# EAGLE design W404C (EAGLE 6.6.0)
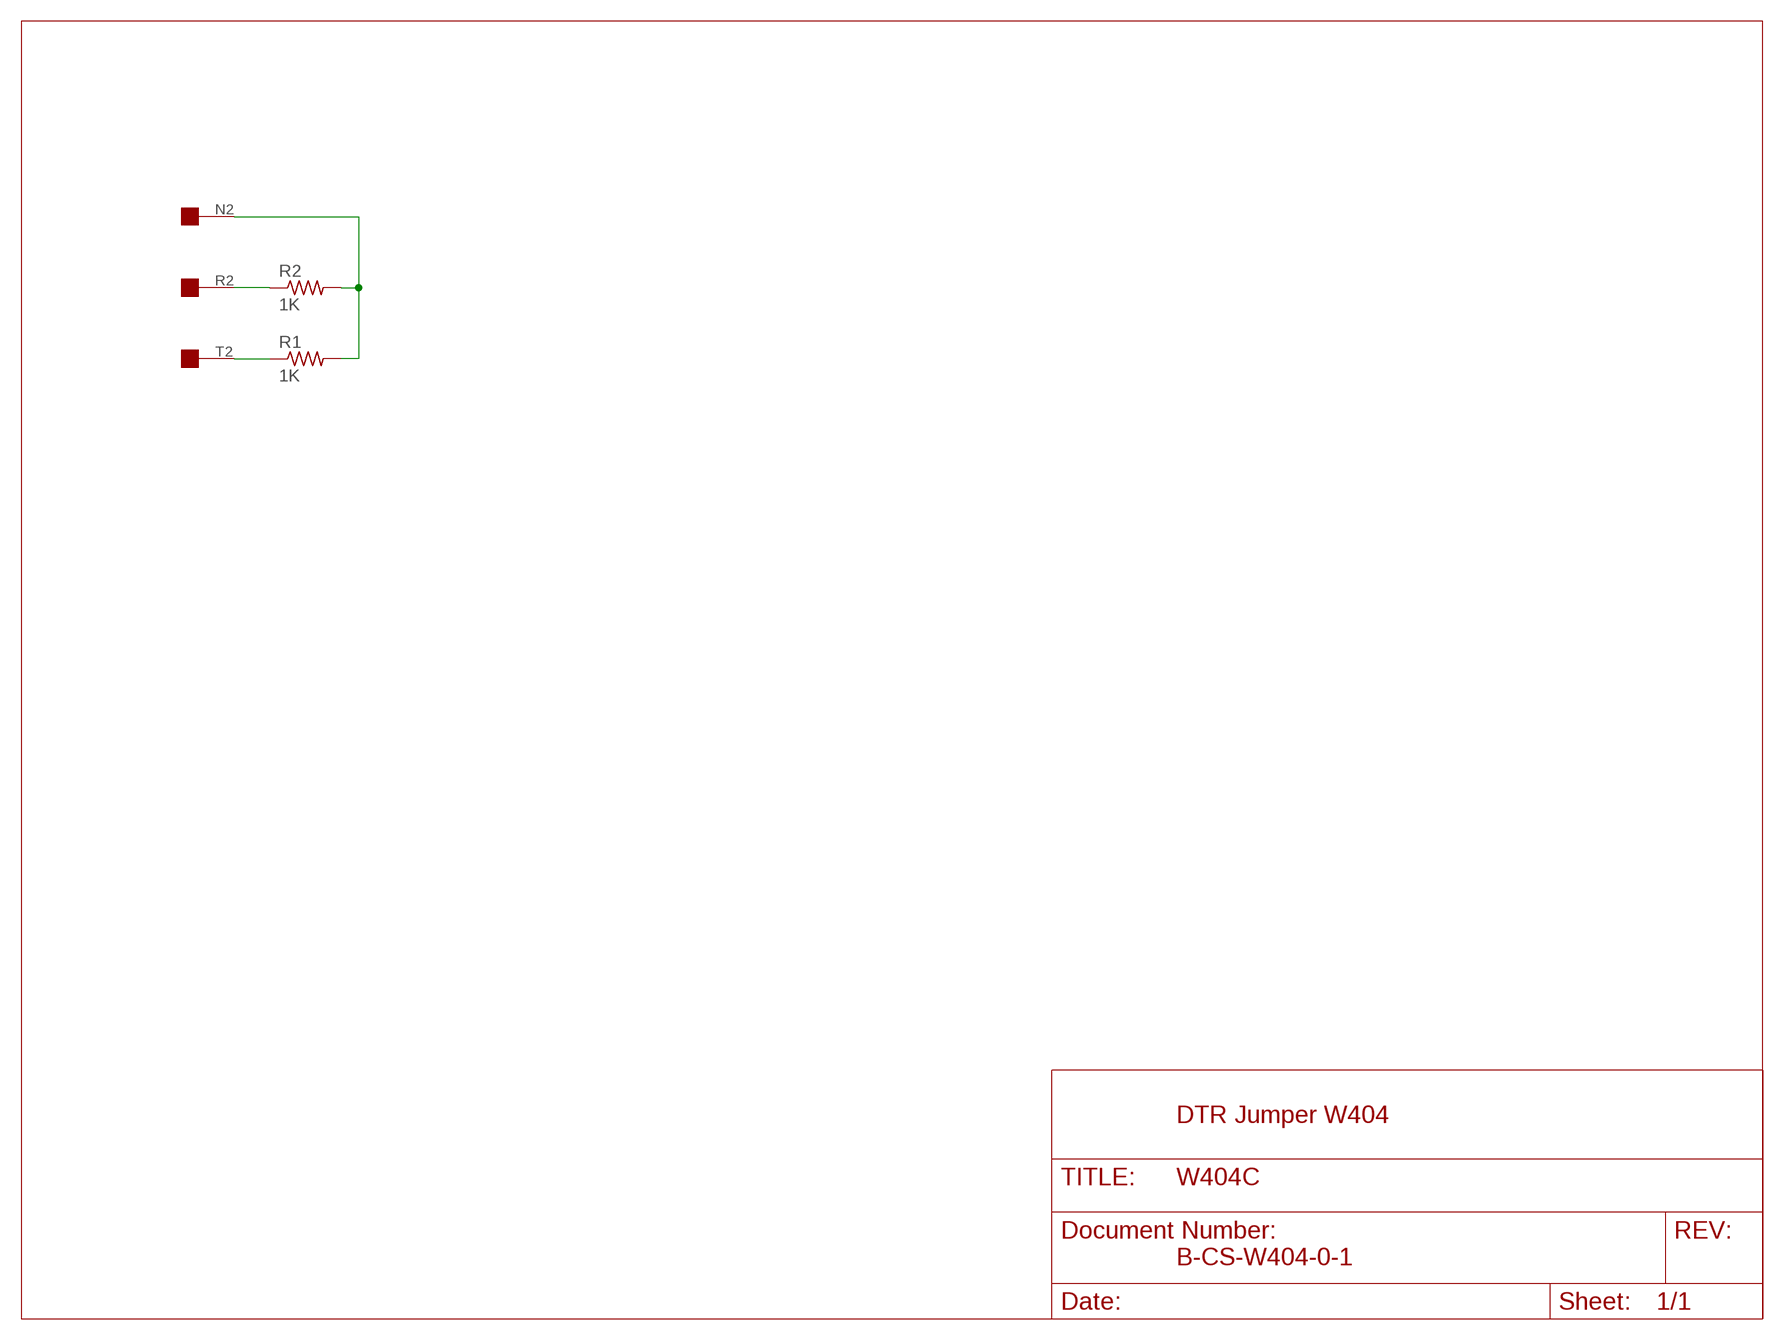
[diagram p0: schematic, sheet 1]

## Parts
R1  1K  R-US_0818/25  [0818/25]
R2  1K  R-US_0818/25  [0818/25]
U$2  EDGE-1  [EDGE-CON1]

## Nets
N$1: R1.2 R2.2 U$2.N2
N$10: R2.1 U$2.R2
N$11: R1.1 U$2.T2
Unconnected: U$2.A2 U$2.B2 U$2.C2 U$2.D2 U$2.E2 U$2.F2 U$2.H2 U$2.J2 U$2.K2 U$2.L2 U$2.M2 U$2.P2 U$2.S2 U$2.U2 U$2.V2

## Notes on the sheet
- DTR Jumper W404
- B-CS-W404-0-1

## Library data of the parts
R1 R2 = dec-con:R-US_0818/25: One inch resistor
U$2 = dec-con:EDGE-1: Single-Sided DEC Edge Connector -- (side 2)

## Net classes
0 default: width 0.813 mm
1 Supply: width 0.813 mm

## Board
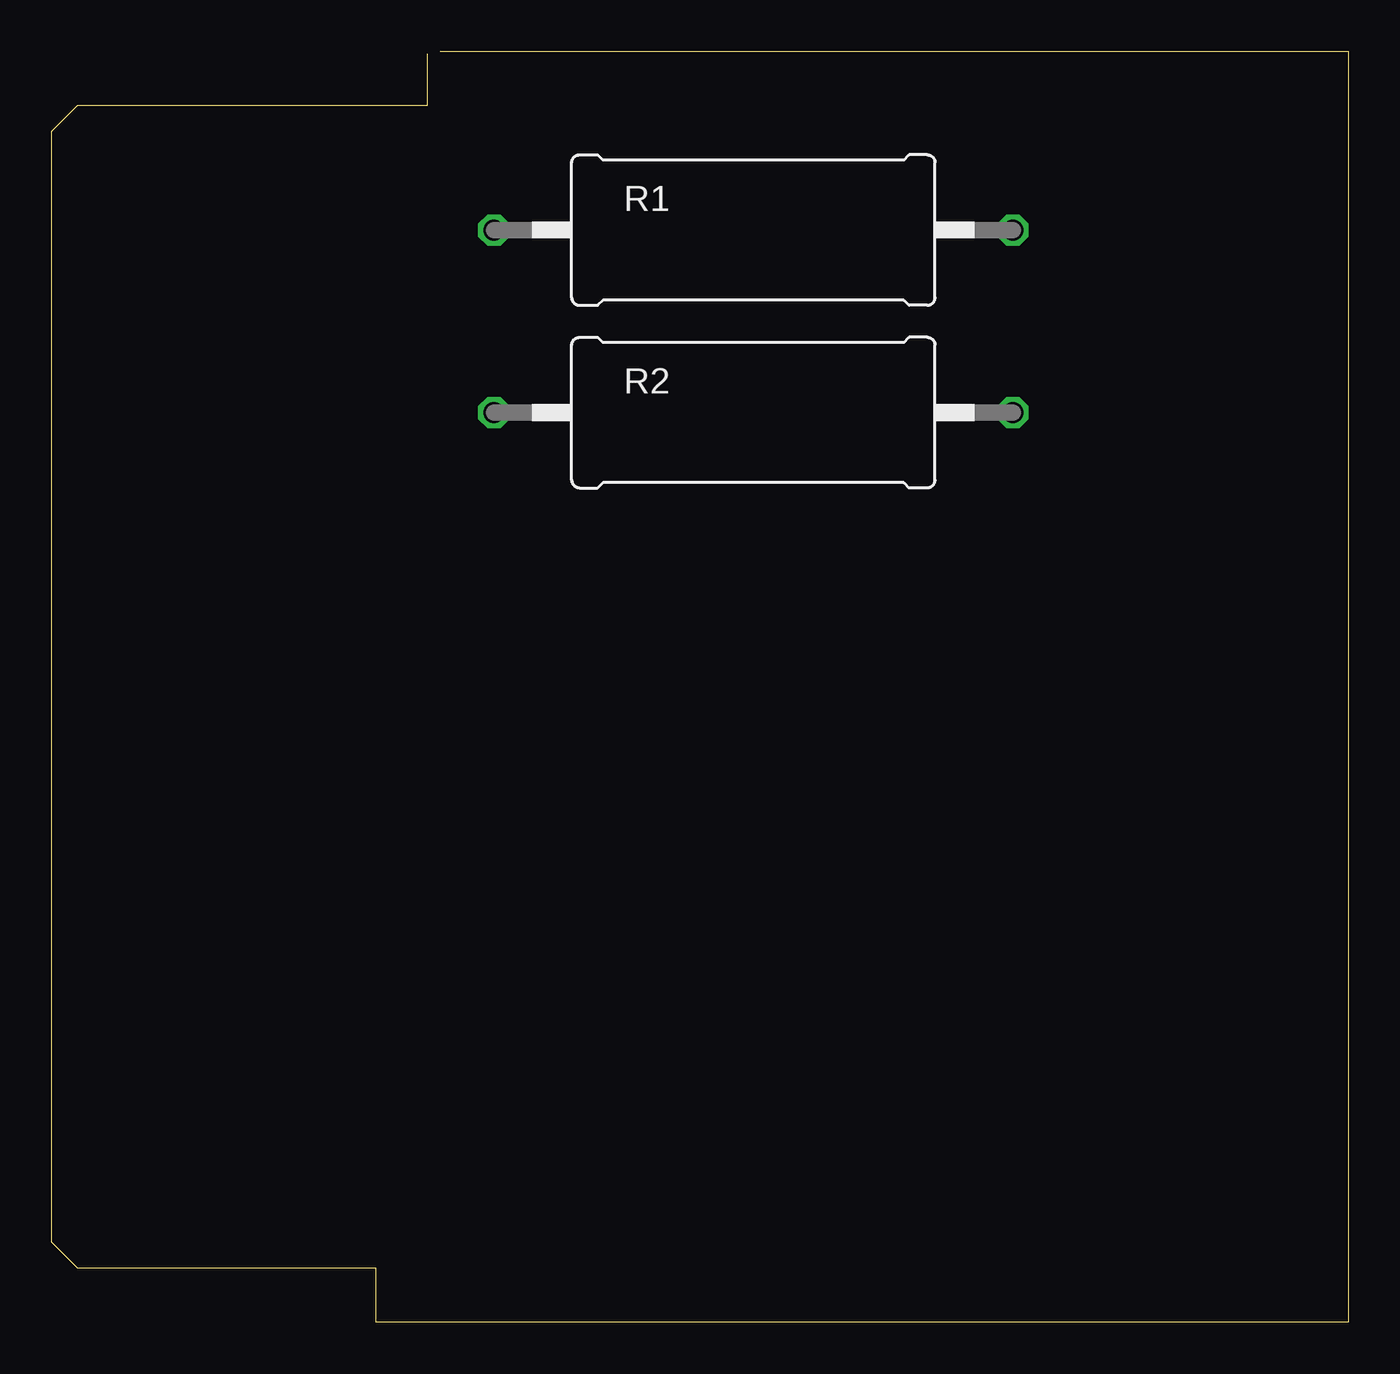
[diagram p1: board, top side]
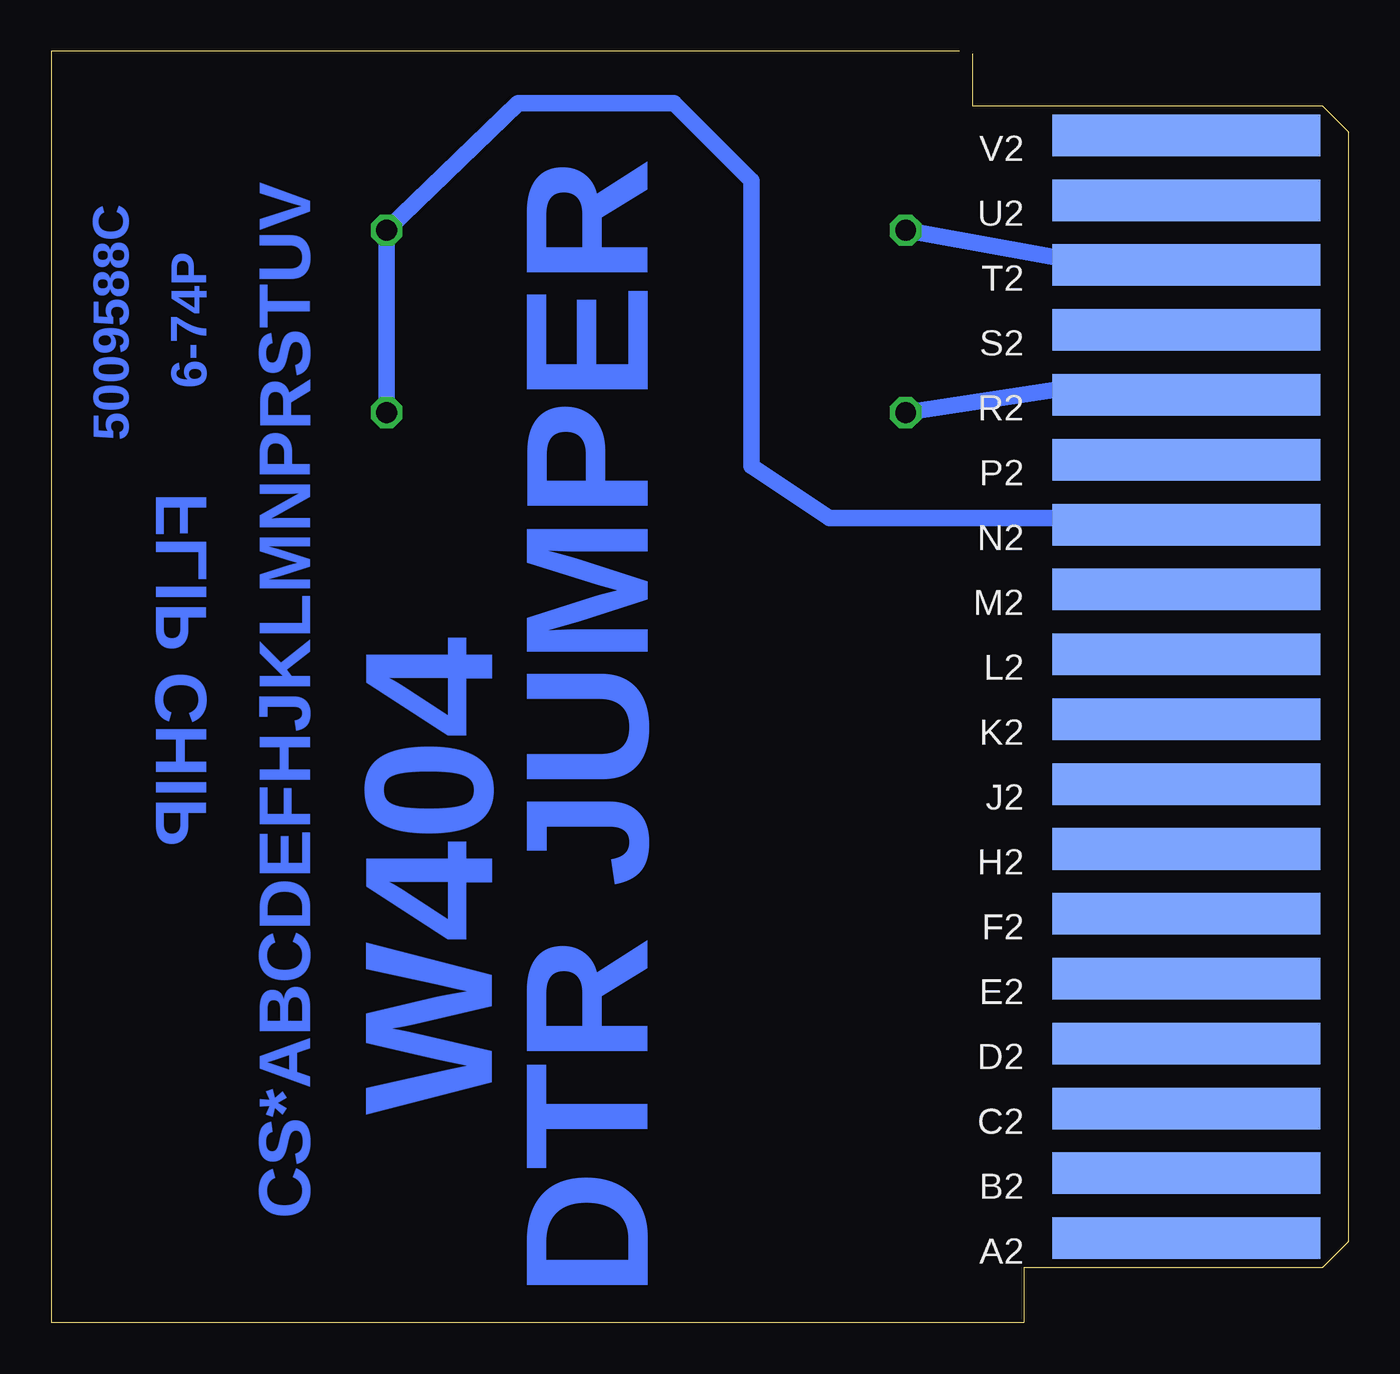
[diagram p2: board, bottom side, seen from below]

Size 63.5 x 62.23 mm. Coordinates in mm from the lower left corner, seen from the top.
Outline: 19.05,62.23 63.5,62.23 63.5,0 15.88,0
Copper layers (1+16): Top 0.035mm / dielectric 1.5mm / Bottom 0.035mm
Design rules "16mils": minimum track width 16mil, minimum drill 32mil, track to track 15mil, track to pad 10mil, pad to pad 10mil, via to via 10mil, smd to smd 10mil, copper to edge 13mil, drill to drill 10mil, minimum pad ring 10mil, minimum via ring 8mil, stop-mask expansion 0mil, vias tented up to drill 0mil, thermal gap 10mil

### Footprints (pad centres in the part's own frame; a part is rotated, then mirrored left to right if it is on the bottom)
0818/25 = drill 1.016 octagon: 1 -12.7,0; 2 12.7,0
EDGE-CON1 = smd 13.106 x 2.032 bottom: A2 7.938,4.128; B2 7.938,7.303; C2 7.938,10.477; D2 7.938,13.652; E2 7.938,16.828; F2 7.938,20.003; H2 7.938,23.177; J2 7.938,26.352; K2 7.938,29.527; L2 7.938,32.703; M2 7.938,35.877; N2 7.938,39.053; P2 7.938,42.227; R2 7.938,45.403; S2 7.938,48.578; T2 7.938,51.752; U2 7.938,54.928; V2 7.938,58.102

### Placement (x,y rotation side)
R1  34.37,53.47 0 top
R2  34.37,44.54 0 top
U$2  0,0 0 top

### Tracks (layer width: path | path; a pad name or v marks a point on that pad's centre or on a via)
N$1
  Bottom 0.813: U$2.N2 8.89,39.37 25.4,39.37 29.21,41.91 29.21,55.88 33.02,59.69 40.64,59.69 R1.2 R2.2
N$10
  Bottom 0.813: U$2.R2 8.89,45.72 13.97,45.72 R2.1
N$11
  Bottom 0.813: U$2.T2 8.89,51.75 8.89,52.07 13.97,52.07 R1.1

### Text on the board
Bottom: 6-74P | 5009588C | FLIP CHIP | W404 | CS*ABCDEFHJKLMNPRSTUV | DTR JUMPER
200bmp: C:/Users/Vince/Documents/eagle/projects/DEC/Wxxx/W404/W404Cbackfb.bmp